# Altium schematic sheet - BLOCK DIAGRAM.SchDoc
size A4; SheetNumber: 2; SheetTotal: 4; ENG_APP_DATE: --/--/--; DSN_APP_DATE: --/--/--; CHK_APP_DATE: --/--/--
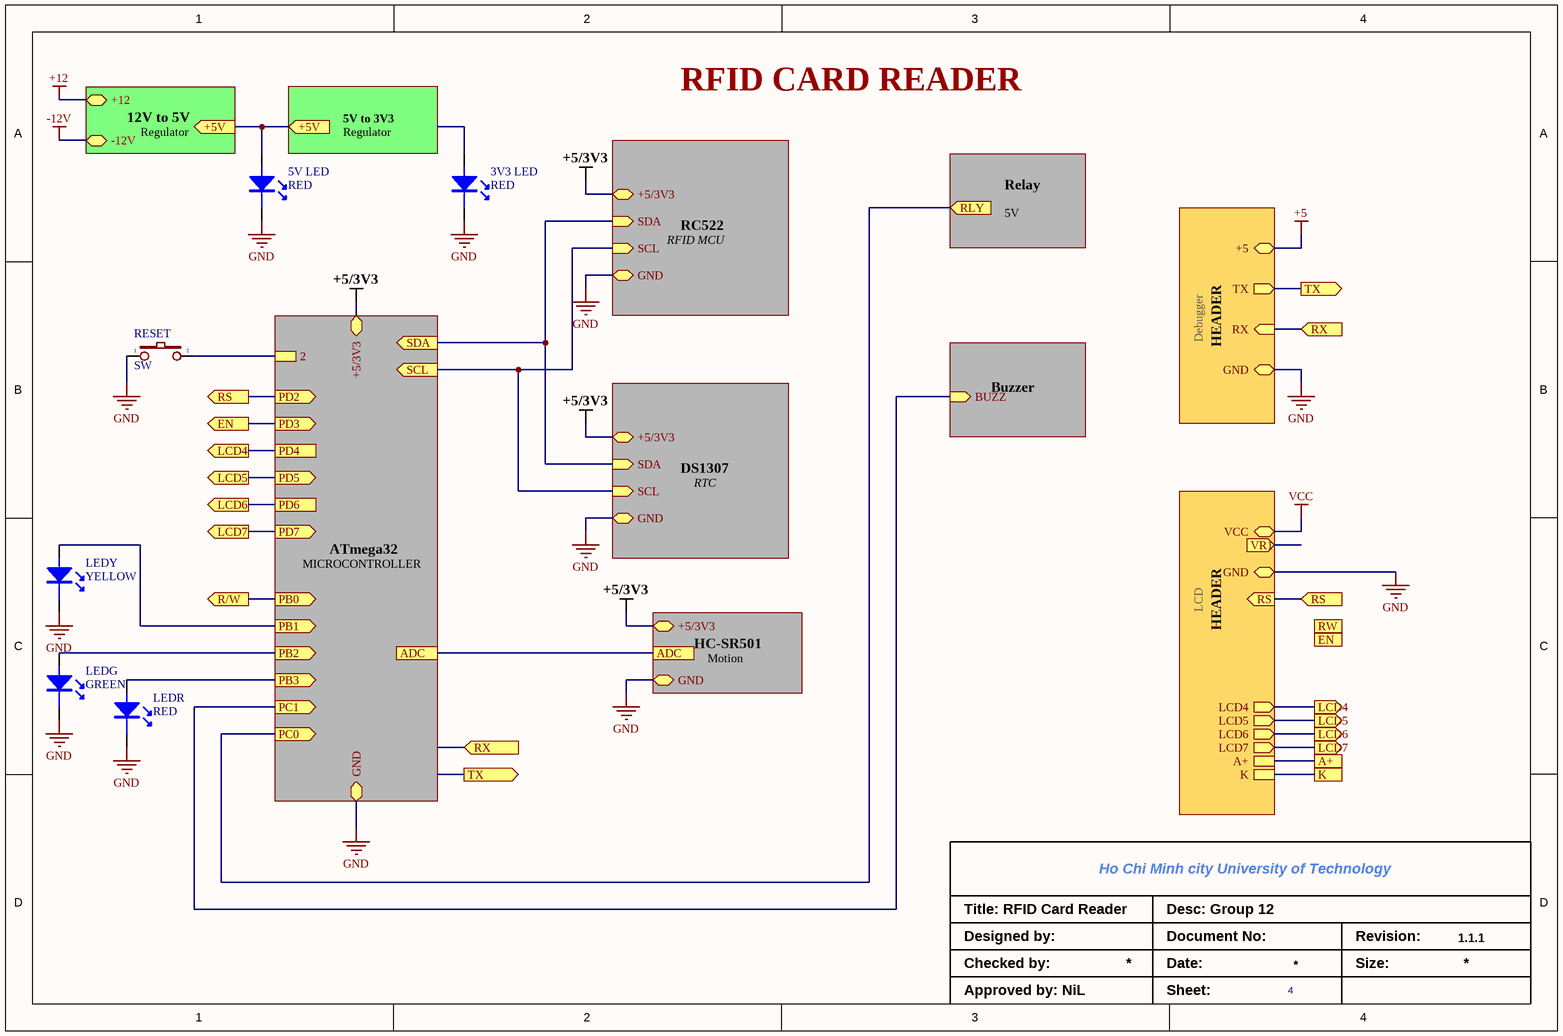
[diagram p0: - BLOCK DIAGRAM.SchDoc]

## Parts
3V3_LED  RED  [CAP10UF]
5V_LED  RED  [CAP10UF]
LEDG  GREEN  [CAP10UF]
LEDR  RED  [CAP10UF]
LEDY  YELLOW  [CAP10UF]
RESET  SW  [SW2]

## Sub-sheets
Buzzer = 5V: BUZZ (in)
Debugger = HEADER: RX (in), TX (out), +5 (bidir), GND (bidir)
DS1307 = RTC: SDA (in), SCL (in), +5/3V3 (bidir), GND (bidir)
HC-SR501 = Motion: +5/3V3 (bidir), GND (bidir)
LCD = HEADER: GND (bidir), VCC (bidir), LCD4 (out), LCD5 (out), LCD6 (out), LCD7 (out), A+, K
MICROCONTROLLER = ATmega32: GND (bidir), +5/3V3 (bidir), 2
RC522 = RFID MCU: SDA (in), SCL (in), +5/3V3 (bidir), GND (bidir)
Regulator = 12V to 5V: -12V (bidir), +12 (bidir)
Regulator = 5V to 3V3: no entries
Relay = 5V: no entries

## Ports
+5V (in), +5V (out), A+, ADC, EN (out), K, LCD4 (out), LCD5 (out), LCD6 (out), LCD7 (out), PB0 (out), PB1 (out), PB2 (out), PB3 (out), PC0 (out), PC1 (out), PD2 (out), PD3 (out), PD4, PD5 (out), PD6, PD7 (out), R/W (out), RLY (in), RS (in), RS (out), RW (out), RX (in), SCL (out), SDA (out), TX (out), VR1 (in)

## Nets
+5: sheet Debugger/+5
+5/3V3: sheet MICROCONTROLLER/+5/3V3, sheet RC522/+5/3V3, sheet DS1307/+5/3V3, sheet HC-SR501/+5/3V3
+12: sheet Regulator/+12
-12V: sheet Regulator/-12V
GND: 3V3_LED.2 5V_LED.2 LEDG.2 LEDR.2 LEDY.2 RESET.1 ; sheet MICROCONTROLLER/GND, sheet Debugger/GND, sheet RC522/GND, sheet DS1307/GND, sheet HC-SR501/GND, sheet LCD/GND
VCC: sheet LCD/VCC
+5V: 5V_LED.1 ; port +5V
A+: port A+, sheet LCD/A+
EN: port PD3, port EN
K: port K, sheet LCD/K
LCD4: port PD4, port LCD4, sheet LCD/LCD4
LCD5: port PD5, port LCD5, sheet LCD/LCD5
LCD6: port PD6, port LCD6, sheet LCD/LCD6
LCD7: port PD7, port LCD7, sheet LCD/LCD7
PB0: port PB0, port R/W
PB1: LEDY.1 ; port PB1
PB2: LEDG.1 ; port PB2
PB3: LEDR.1 ; port PB3
PC0: port PC0, port RLY
PC1: port PC1, sheet Buzzer/BUZZ
PD2: port RS, port PD2
RX: port RX, sheet Debugger/RX
SCL: port SCL, sheet RC522/SCL, sheet DS1307/SCL
SDA: port SDA, sheet RC522/SDA, sheet DS1307/SDA
TX: port TX, sheet Debugger/TX
NetRESET_2: RESET.2 ; sheet MICROCONTROLLER/2

Not connected (* = marked no-connect by the designer): 3V3_LED 1

## Notes on the sheet
- RFID CARD READER
- Title: RFID Card Reader
- Ho Chi Minh city University of Technology
- Desc: Group 12
- Designed by:
- Checked by:
- Approved by: NiL
- Date:
- Sheet:
- Document No:
- Revision:
- Size:
- 1.1.1

## Library data of the parts
3V3_LED 5V_LED LEDG LEDR LEDY = LED
RESET = SW2: Switch button 2 pin; Value: SW chip 2 pin